# EAGLE schematic solid-state-output-transformer-v1 (EAGLE 9.2.2)
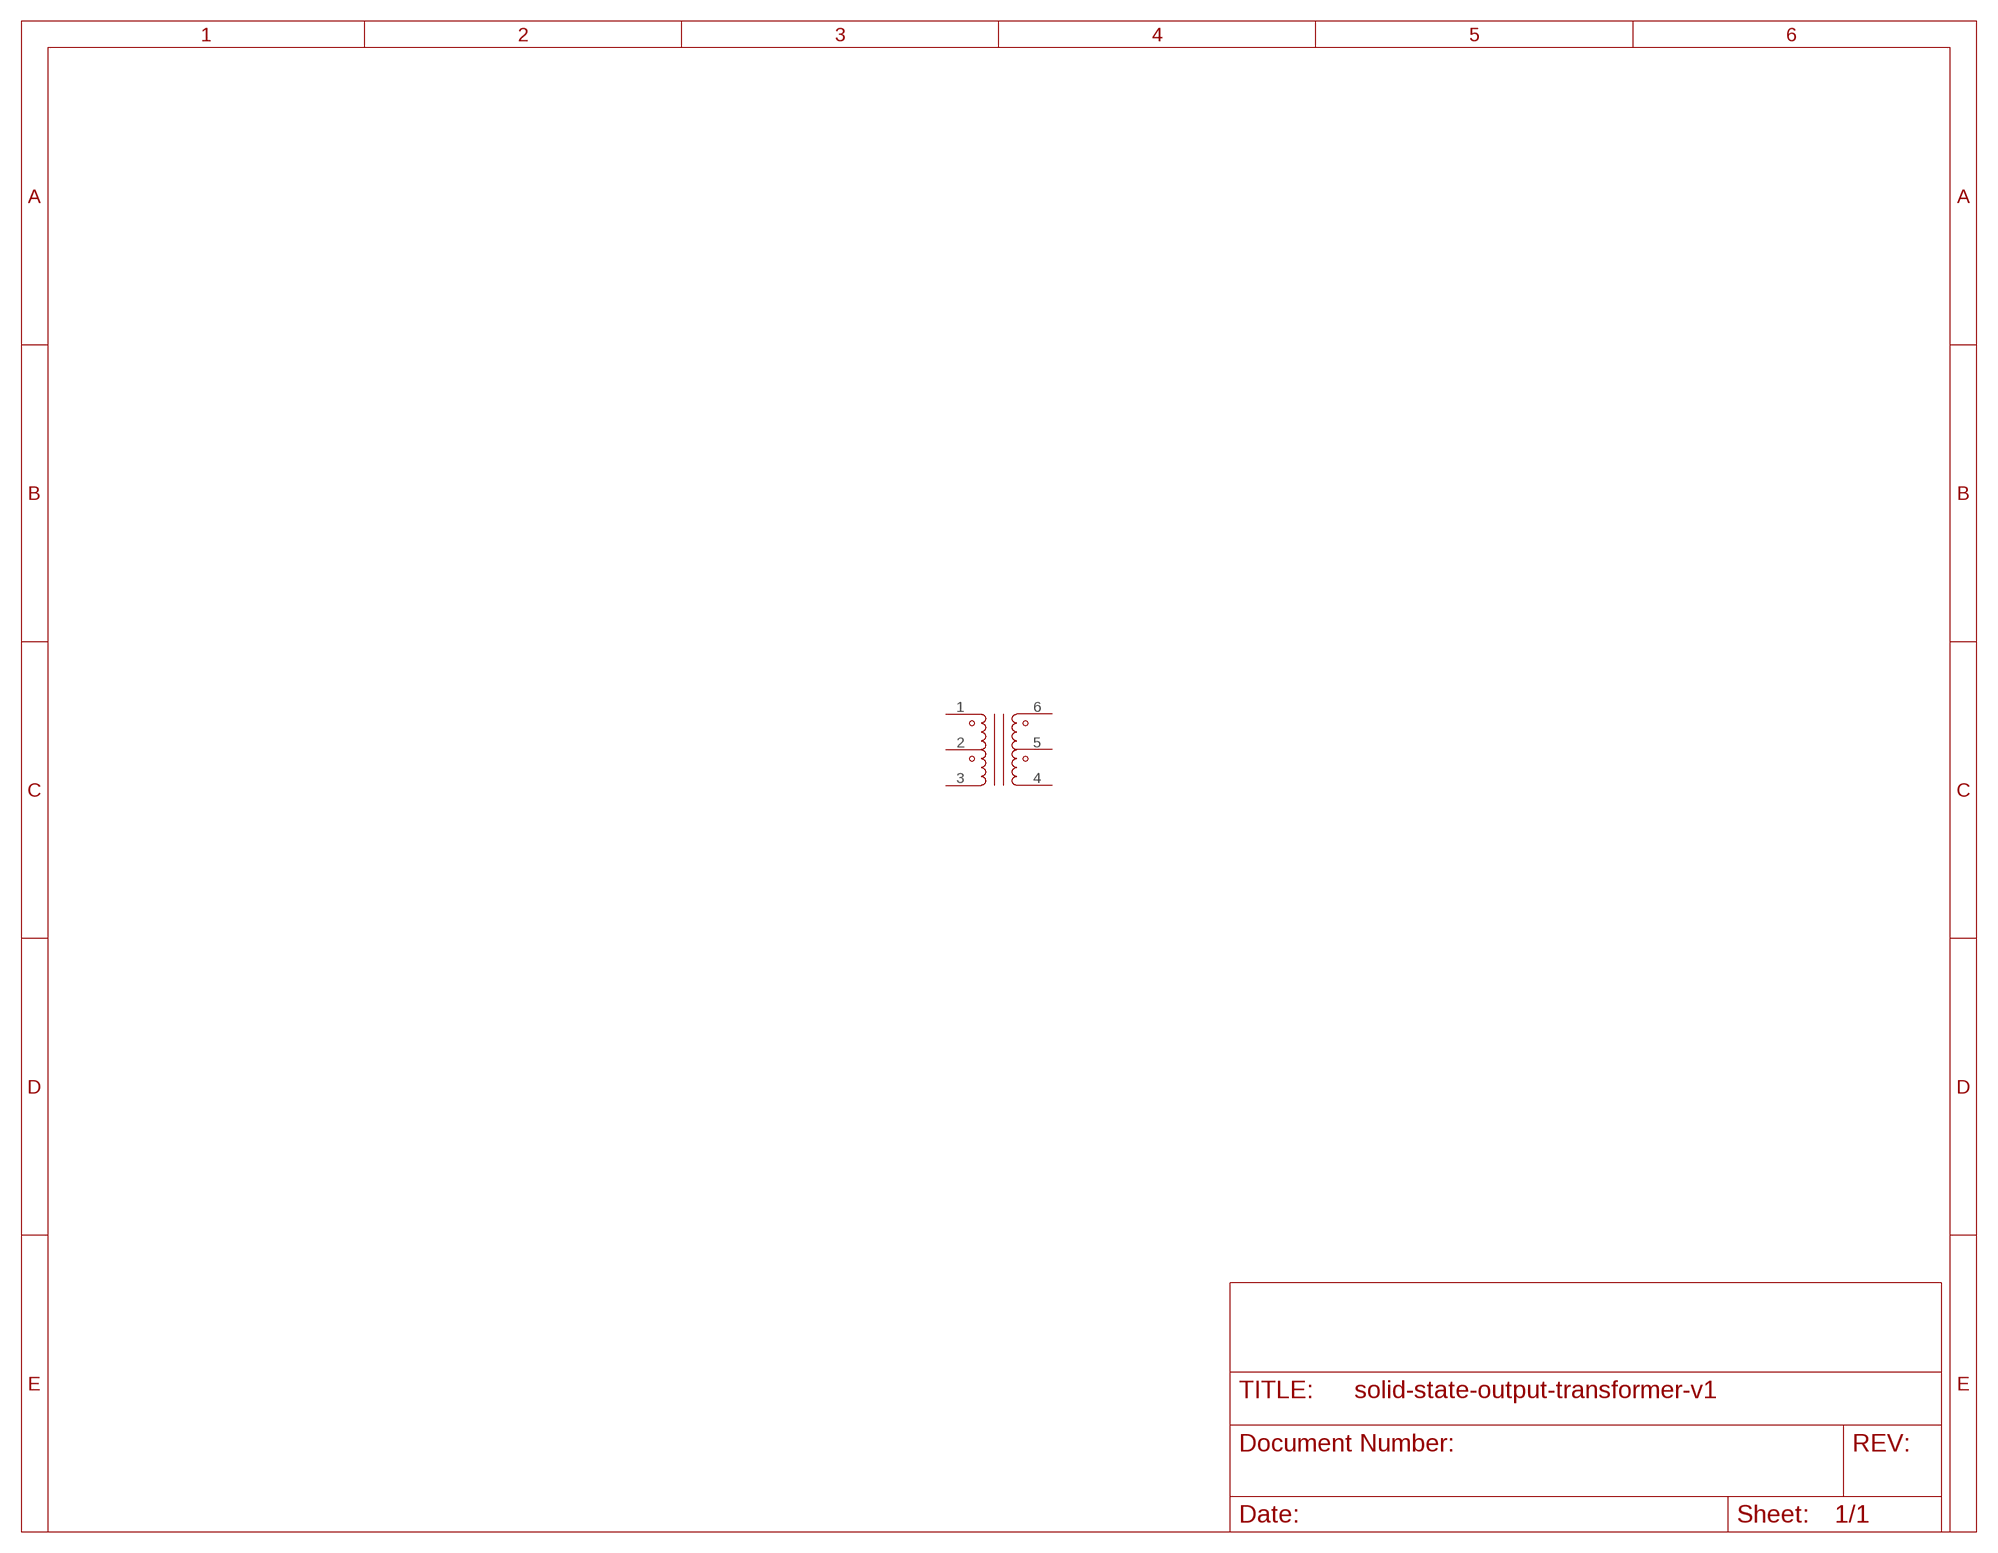
[diagram p0: schematic, sheet 1]

## Parts
XFMR1  COILCRAFT-A9784-BL_  XFMR-COILCRAFT-A9784-BL_  [XFMR-COILCRAFT-A9784-BL_]
Unconnected: XFMR1.1(INPUT_TOP) XFMR1.2(INPUT_MIDDLE) XFMR1.3(INPUT_BOTTOM) XFMR1.4(OUTPUT_BOTTOM) XFMR1.5(OUTPUT_MIDDLE) XFMR1.6(OUTPUT_TOP)

## Library data of the parts
XFMR1 = tube-audio-library:XFMR-COILCRAFT-A9784-BL_